# EAGLE design elysium_v0_6 (EAGLE 6.5.0)
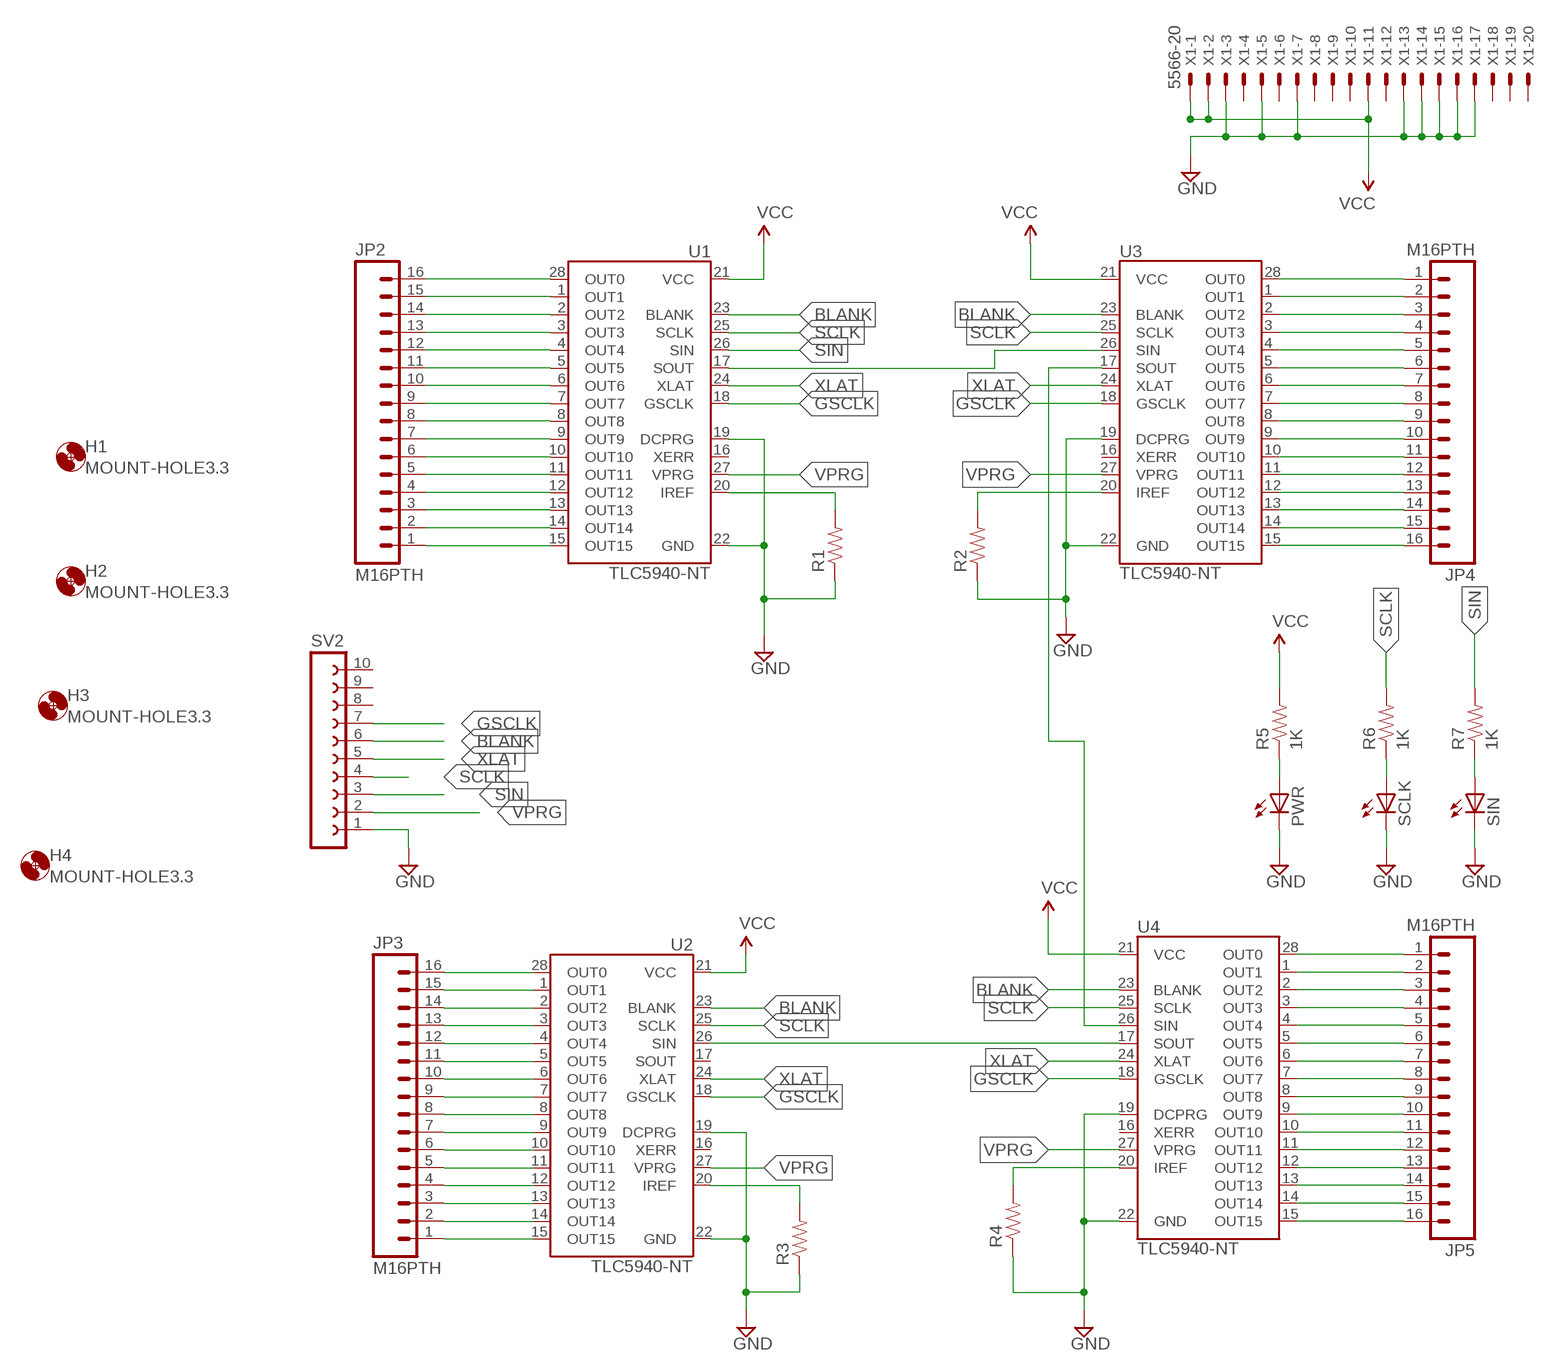
[diagram p0: schematic, sheet 1]

## Parts
H1  MOUNT-HOLE3.3  [3,3]
H2  MOUNT-HOLE3.3  [3,3]
H3  MOUNT-HOLE3.3  [3,3]
H4  MOUNT-HOLE3.3  [3,3]
JP2  M16PTH  [1X16]
JP3  M16PTH  [1X16]
JP4  M16PTH  [1X16]
JP5  M16PTH  [1X16]
PWR  LED5MM  [LED5MM]
R1  RESISTOREZ  [AXIAL-0.3EZ]
R2  RESISTOREZ  [AXIAL-0.3EZ]
R3  RESISTOREZ  [AXIAL-0.3EZ]
R4  RESISTOREZ  [AXIAL-0.3EZ]
R5  1K  RESISTOREZ  [AXIAL-0.3EZ]
R6  1K  RESISTOREZ  [AXIAL-0.3EZ]
R7  1K  RESISTOREZ  [AXIAL-0.3EZ]
SCLK  LED5MM  [LED5MM]
SIN  LED5MM  [LED5MM]
SV2  FE10-1  [FE10]
U1  TLC5940-NT  [DIL28-3]
U2  TLC5940-NT  [DIL28-3]
U3  TLC5940-NT  [DIL28-3]
U4  TLC5940-NT  [DIL28-3]
X1  5566-20  [5566-20]

## Nets
BLANK: SV2.6 U1.23(BLANK) U2.23(BLANK) U3.23(BLANK) U4.23(BLANK)
GND: PWR.K(C) R1.P$1 R2.P$1 R3.P$1 R4.P$1 SCLK.K(C) SIN.K(C) SV2.1 U1.19(DCPRG) U1.22(GND) U2.19(DCPRG) U2.22(GND) U3.19(DCPRG) U3.22(GND) U4.19(DCPRG) U4.22(GND) X1.3 X1.5 X1.7 X1.13 X1.14 X1.15 X1.16 X1.17
GSCLK: SV2.7 U1.18(GSCLK) U2.18(GSCLK) U3.18(GSCLK) U4.18(GSCLK)
N$1: JP2.16 U1.28(OUT0)
N$2: JP2.15 U1.1(OUT1)
N$3: JP2.14 U1.2(OUT2)
N$4: JP2.13 U1.3(OUT3)
N$5: JP2.12 U1.4(OUT4)
N$6: JP2.11 U1.5(OUT5)
N$7: JP2.10 U1.6(OUT6)
N$8: JP2.9 U1.7(OUT7)
N$9: JP2.8 U1.8(OUT8)
N$10: JP2.7 U1.9(OUT9)
N$11: JP2.6 U1.10(OUT10)
N$12: JP2.5 U1.11(OUT11)
N$13: JP2.4 U1.12(OUT12)
N$14: JP2.3 U1.13(OUT13)
N$15: JP2.2 U1.14(OUT14)
N$16: JP2.1 U1.15(OUT15)
N$17: JP4.1 U3.28(OUT0)
N$18: JP4.2 U3.1(OUT1)
N$19: JP4.3 U3.2(OUT2)
N$20: JP4.4 U3.3(OUT3)
N$21: JP4.5 U3.4(OUT4)
N$22: JP4.6 U3.5(OUT5)
N$23: JP4.7 U3.6(OUT6)
N$24: JP4.8 U3.7(OUT7)
N$25: JP4.9 U3.8(OUT8)
N$26: JP4.10 U3.9(OUT9)
N$27: JP4.11 U3.10(OUT10)
N$28: JP4.12 U3.11(OUT11)
N$29: JP4.13 U3.12(OUT12)
N$30: JP4.14 U3.13(OUT13)
N$31: JP4.15 U3.14(OUT14)
N$32: JP4.16 U3.15(OUT15)
N$33: JP3.16 U2.28(OUT0)
N$34: JP3.15 U2.1(OUT1)
N$35: JP3.14 U2.2(OUT2)
N$36: JP3.13 U2.3(OUT3)
N$37: JP3.12 U2.4(OUT4)
N$38: JP3.11 U2.5(OUT5)
N$39: JP3.10 U2.6(OUT6)
N$40: JP3.9 U2.7(OUT7)
N$41: JP3.8 U2.8(OUT8)
N$42: JP3.7 U2.9(OUT9)
N$43: JP3.6 U2.10(OUT10)
N$44: JP3.5 U2.11(OUT11)
N$45: JP3.4 U2.12(OUT12)
N$46: JP3.3 U2.13(OUT13)
N$47: JP3.2 U2.14(OUT14)
N$48: JP3.1 U2.15(OUT15)
N$49: JP5.1 U4.28(OUT0)
N$50: JP5.2 U4.1(OUT1)
N$51: JP5.3 U4.2(OUT2)
N$52: JP5.4 U4.3(OUT3)
N$53: JP5.5 U4.4(OUT4)
N$54: JP5.6 U4.5(OUT5)
N$55: JP5.7 U4.6(OUT6)
N$56: JP5.8 U4.7(OUT7)
N$57: JP5.9 U4.8(OUT8)
N$58: JP5.10 U4.9(OUT9)
N$59: JP5.11 U4.10(OUT10)
N$60: JP5.12 U4.11(OUT11)
N$61: JP5.13 U4.12(OUT12)
N$62: JP5.14 U4.13(OUT13)
N$63: JP5.15 U4.14(OUT14)
N$64: JP5.16 U4.15(OUT15)
N$65: U1.17(SOUT) U3.26(SIN)
N$66: U3.17(SOUT) U4.26(SIN)
N$67: U2.26(SIN) U4.17(SOUT)
N$68: R1.P$2 U1.20(IREF)
N$69: PWR.A R5.P$1
N$70: R2.P$2 U3.20(IREF)
N$74: R6.P$1 SCLK.A
N$75: R3.P$2 U2.20(IREF)
N$76: R7.P$1 SIN.A
N$77: R4.P$2 U4.20(IREF)
SCLK: R6.P$2 SV2.4 U1.25(SCLK) U2.25(SCLK) U3.25(SCLK) U4.25(SCLK)
SIN: R7.P$2 SV2.3 U1.26(SIN)
VCC: R5.P$2 U1.21(VCC) U2.21(VCC) U3.21(VCC) U4.21(VCC) X1.1 X1.2 X1.11
VPRG: SV2.2 U1.27(VPRG) U2.27(VPRG) U3.27(VPRG) U4.27(VPRG)
XLAT: SV2.5 U1.24(XLAT) U2.24(XLAT) U3.24(XLAT) U4.24(XLAT)
Unconnected: SV2.8 SV2.9 SV2.10 U1.16(XERR) U2.16(XERR) U2.17(SOUT) U3.16(XERR) U4.16(XERR) X1.4 X1.6 X1.8 X1.9 X1.10 X1.12 X1.18 X1.19 X1.20

## Library data of the parts
H1-H4 = holes:MOUNT-HOLE: MOUNTING HOLE with drill center marker
JP2-JP5 = SparkFun-Connectors:M16: 1x16 .1" header
PWR SCLK SIN = adafruit:LED: LED OSRAM: - CHIPLED LG R971, LG N971, LY N971, LG Q971, LY Q971, LO R971, LY R971 LH N974, LH R974 LS Q976, LO Q976, LY Q976 LO Q996 - Hyper CHIPLED LW Q18S LB Q993, LB Q99A, LB R99A - SideLED LS A670, LO A670, LY A670, LG A670, LP A670 LB A673, LV A673, LT A673, LW A673 LH A674 LY A675 LS A676, LA A676, LO A676, LY A676, LW A676 LS A679, LY A679, LG A679 - Hyper Micro SIDELED® LS Y876, LA Y876, LO Y876, LY Y876 LT Y87S - SmartLED LW L88C, LW L88S LB L89C, LB L89S, LG L890 LS L89K, LO L89K, LY L89K LS L896, LA L896, LO L896, LY L896 - TOPLED LS T670, LO T670, LY T670, LG T670, LP T670 LSG T670, LSP T670, LSY T670, LOP T670, LYG T670 LG T671, LOG T671, LSG T671 LB T673, LV T673, LT T673, LW T673 LH T674 LS T676, LA T676, LO T676, LY T676, LB T676, LH T676, LSB T676, LW T676 LB T67C, LV T67C, LT T67C, LS T67K, LO T67K, LY T67K, LW E67C LS E67B, LA E67B, LO E67B, LY E67B, LB E67C, LV E67C, LT E67C LW T67C LS T679, LY T679, LG T679 LS T770, LO T770, LY T770, LG T770, LP T770 LB T773, LV T773, LT T773, LW T773 LH T774 LS E675, LA E675, LY E675, LS T675 LS T776, LA T776, LO T776, LY T776, LB T776 LHGB T686 LT T68C, LB T68C - Hyper Mini TOPLED® LB M676 - Mini TOPLED Santana® LG M470 LS M47K, LO M47K, LY M47K Source: http://www.osram.convergy.de/
R1-R7 = SparkFun-Resistors:RESISTOR: Resistor Basic schematic elements and footprints for 0603, 1206, and PTH resistors.
SV2 = con-lsta:FE10-1: FEMALE HEADER; OC_FARNELL: unknown; OC_NEWARK: unknown
U1-U4 = SparkFun-DigitalIC:TLC5940: 16-channel LED Driver with Dot Correction and Grayscale PWM Control The TLC5940 is a 16-channel, constant-current sink LED driver. Each channel has an individually adjustable 4096-step grayscale PWM brightness control and a 64-step, constant-current sink (dot correction). The dot correction adjusts the brightness variations between LED channels and other LED drivers. The dot correction data is stored in an integrated EEPROM. Both grayscale control and dot correction are accessible via a serial interface. A single external resistor sets the maximum current value of all 16 channels. Packages: 28-pin HTSSOP 32-pin 5x5mm QFN 28-pin DIP
X1 = con-molex:5566-20: Mini FIT connector 20 pol ATX PC-Motherboard Power connector Source: http://www.molex.com; OC_FARNELL: unknown; OC_NEWARK: unknown

## Board
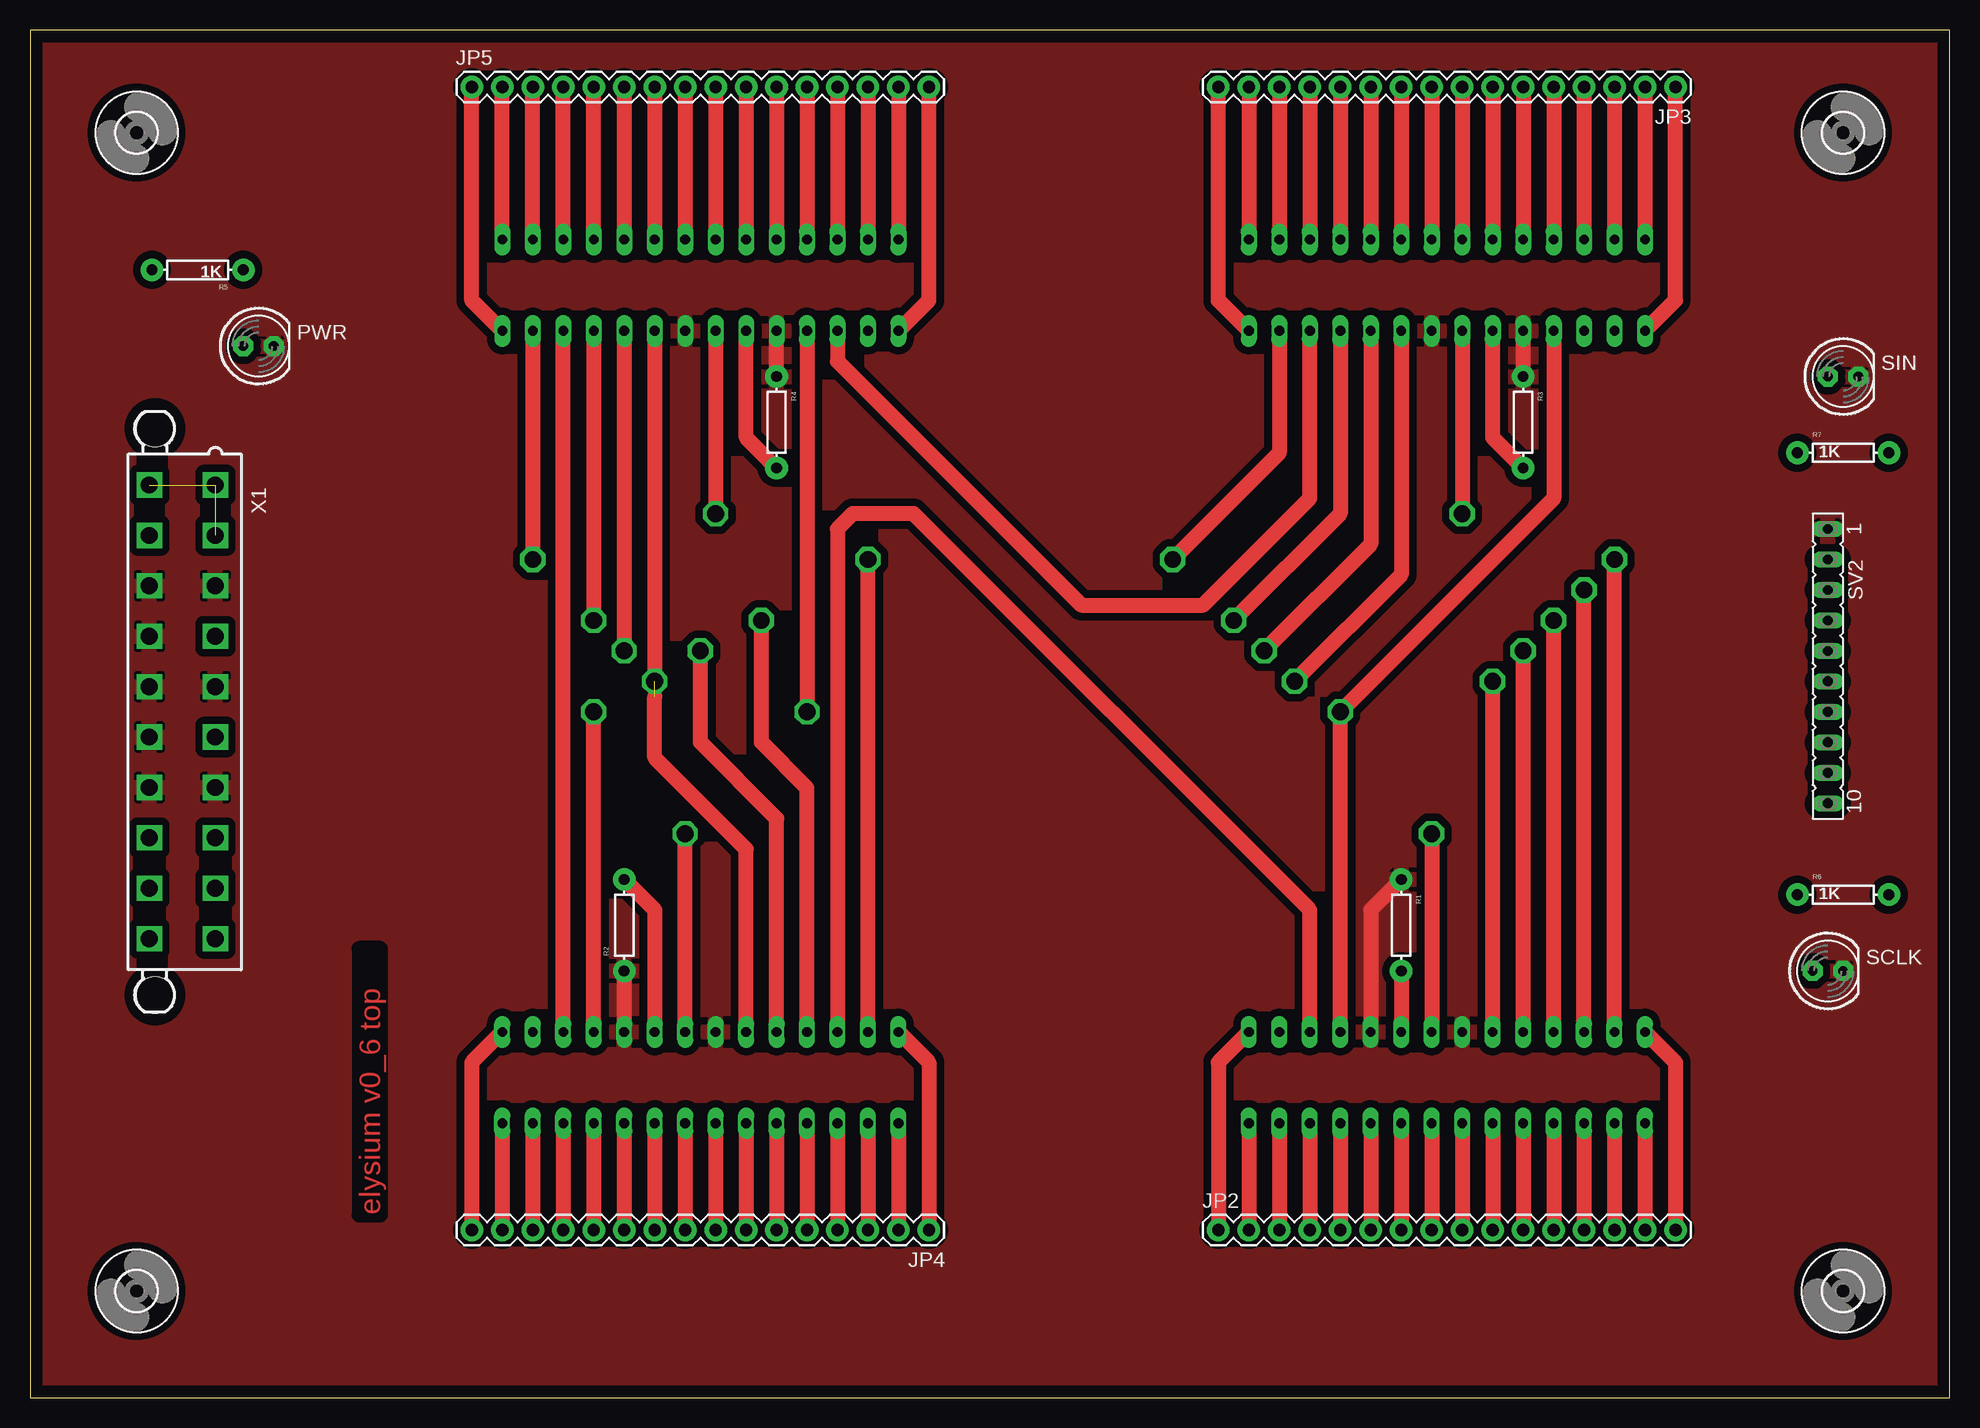
[diagram p1: board, top side]
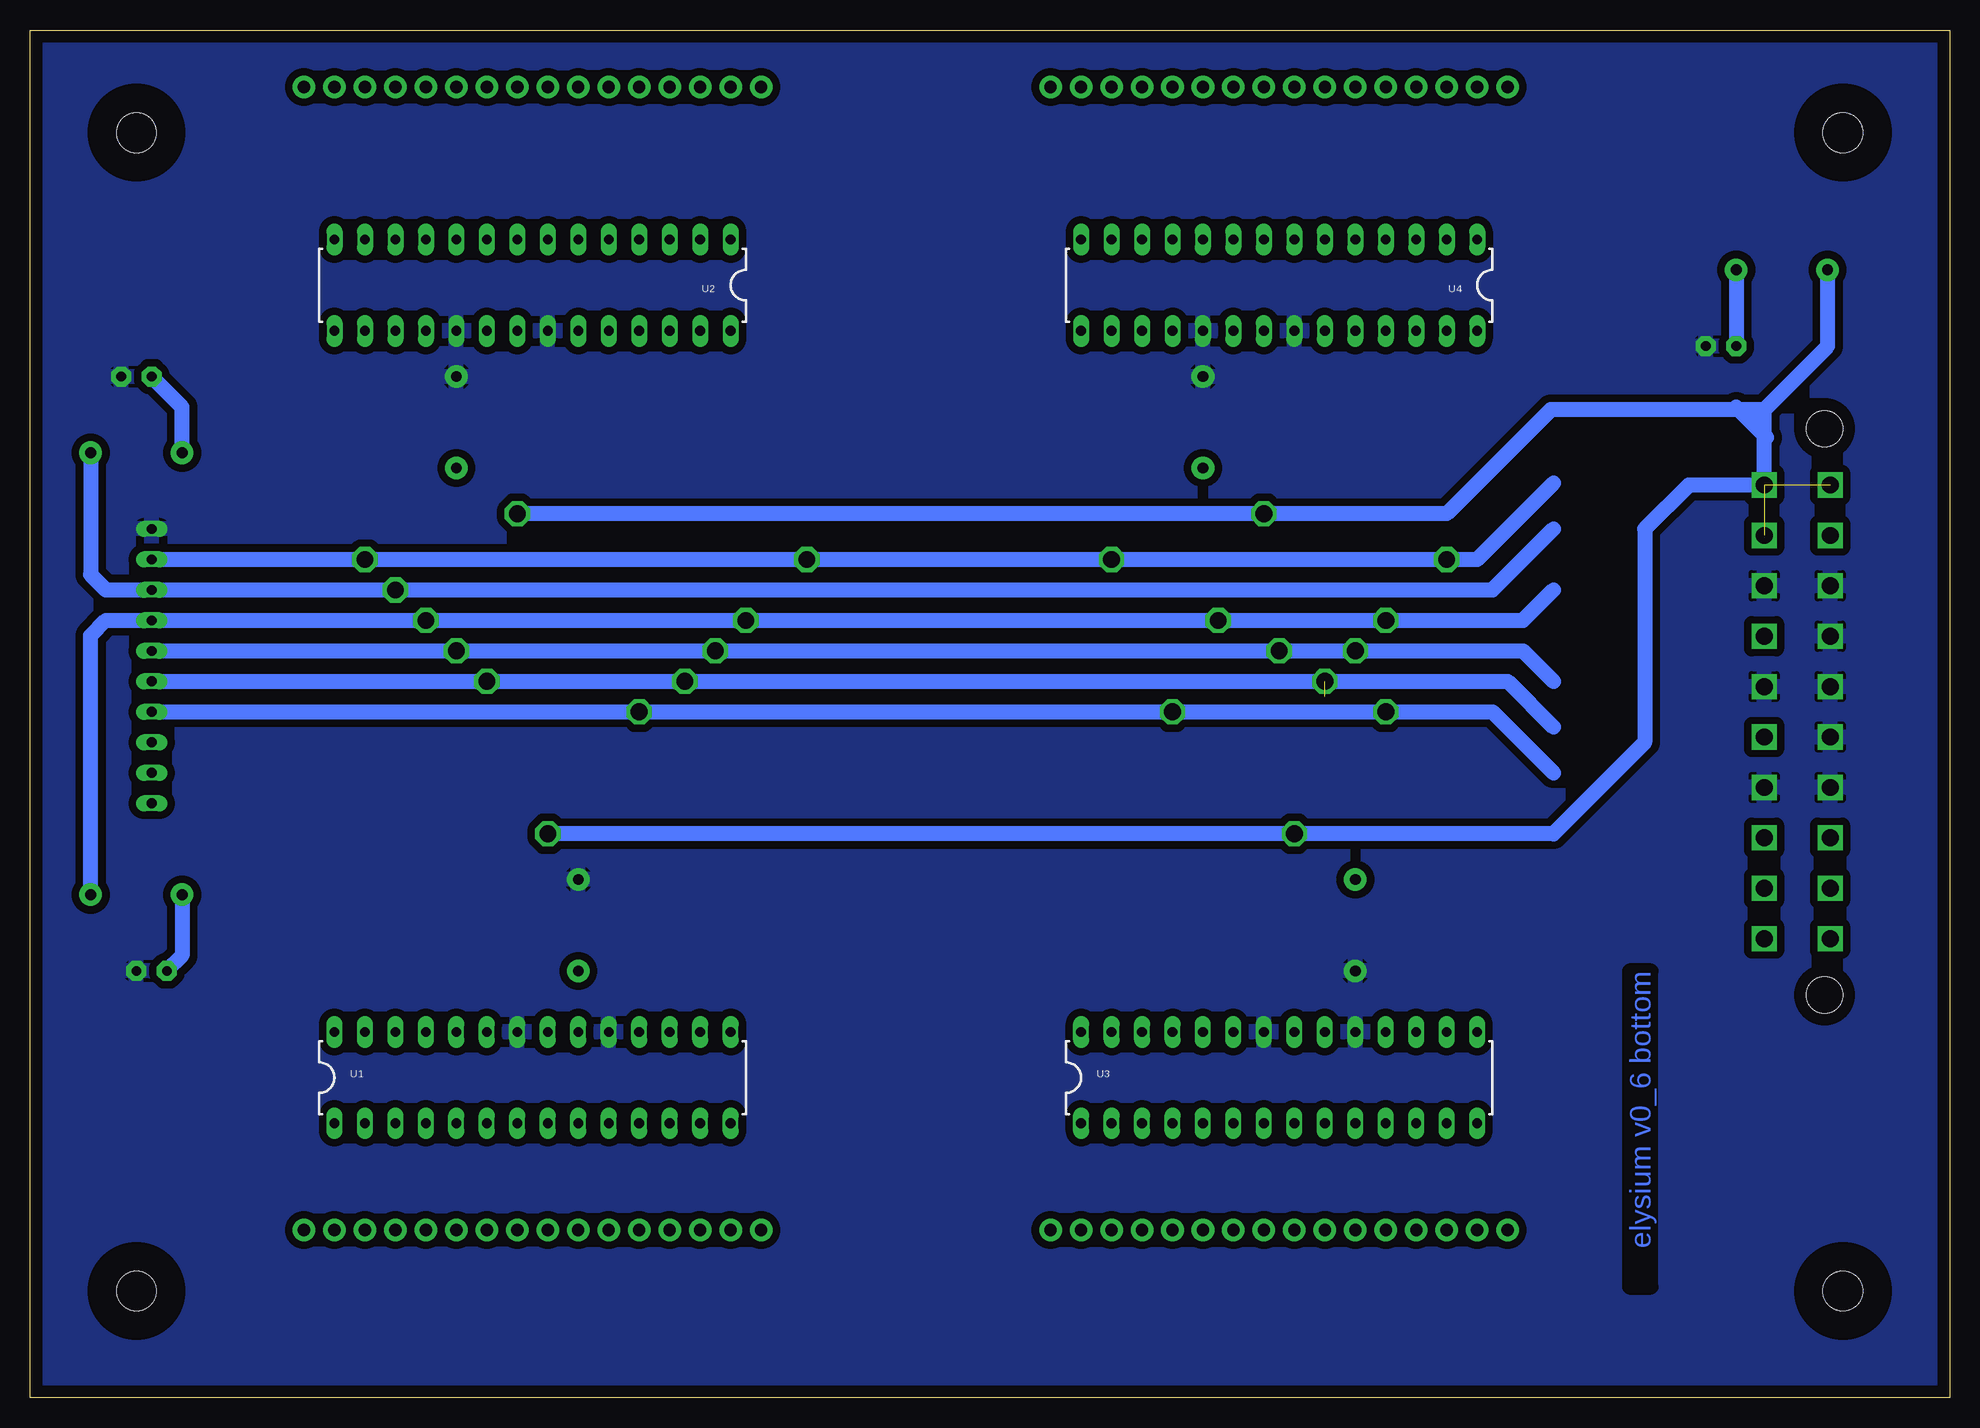
[diagram p2: board, bottom side, seen from below]

Size 160 x 113.97 mm. Coordinates in mm from the lower left corner, seen from the top.
Outline: 0,0 160,0 160,113.97 0,113.97 0,0
Copper layers (1*16): Top 0.035mm / dielectric 1.5mm / Bottom 0.035mm
Design rules "default *": minimum track width 24mil, minimum drill 24mil, track to track 25mil, track to pad 25mil, pad to pad 25mil, via to via 25mil, smd to smd 8mil, copper to edge 40mil, drill to drill 8mil, minimum pad ring 10mil, minimum via ring 8mil, stop-mask expansion 4mil, vias tented up to drill 0mil, thermal gap 10mil

### Footprints (pad centres in the part's own frame; a part is rotated, then mirrored left to right if it is on the bottom)
3,3 = hole 3.3: 0,0
1X16 = drill 1.016 pad 1.88: 1 0,0; 2 2.54,0; 3 5.08,0; 4 7.62,0; 5 10.16,0; 6 12.7,0; 7 15.24,0; 8 17.78,0; 9 20.32,0; 10 22.86,0; 11 25.4,0; 12 27.94,0; 13 30.48,0; 14 33.02,0; 15 35.56,0; 16 38.1,0
LED5MM = drill 0.813 pad 1.676 octagon: A -1.27,0; K 1.27,0
AXIAL-0.3EZ = drill 0.9 pad 1.88: P$1 -3.81,0; P$2 3.81,0
FE10 = drill 0.813 long: 1 -11.43,0; 2 -8.89,0; 3 -6.35,0; 4 -3.81,0; 5 -1.27,0; 6 1.27,0; 7 3.81,0; 8 6.35,0; 9 8.89,0; 10 11.43,0
DIL28-3 = drill 0.813 long: 1 -16.51,-3.81; 2 -13.97,-3.81; 3 -11.43,-3.81; 4 -8.89,-3.81; 5 -6.35,-3.81; 6 -3.81,-3.81; 7 -1.27,-3.81; 8 1.27,-3.81; 9 3.81,-3.81; 10 6.35,-3.81; 11 8.89,-3.81; 12 11.43,-3.81; 13 13.97,-3.81; 14 16.51,-3.81; 15 16.51,3.81; 16 13.97,3.81; 17 11.43,3.81; 18 8.89,3.81; 19 6.35,3.81; 20 3.81,3.81; 21 1.27,3.81; 22 -1.27,3.81; 23 -3.81,3.81; 24 -6.35,3.81; 25 -8.89,3.81; 26 -11.43,3.81; 27 -13.97,3.81; 28 -16.51,3.81
5566-20 = drill 1.4 square: 1 18.9,-2.75; 2 14.7,-2.75; 3 10.5,-2.75; 4 6.3,-2.75; 5 2.1,-2.75; 6 -2.1,-2.75; 7 -6.3,-2.75; 8 -10.5,-2.75; 9 -14.7,-2.75; 10 -18.9,-2.75; 11 18.9,2.75; 12 14.7,2.75; 13 10.5,2.75; 14 6.3,2.75; 15 2.1,2.75; 16 -2.1,2.75; 17 -6.3,2.75; 18 -10.5,2.75; 19 -14.7,2.75; 20 -18.9,2.75 | hole 3: 23.6,2.29; -23.6,2.29

### Placement (x,y rotation side)
H1  8.89,105.41 0 top
H2  8.89,8.89 0 top
H3  151.13,105.41 0 top
H4  151.13,8.89 0 top
JP2  99.06,13.97 0 top
JP3  137.16,109.22 180 top
JP4  74.93,13.97 180 top
JP5  36.83,109.22 0 top
PWR  19.05,87.63 0 top
R1  114.3,39.37 270 top
R2  49.53,39.37 90 top
R3  124.46,81.28 270 top
R4  62.23,81.28 270 top
R5  13.97,93.98 180 top
R6  151.13,41.91 0 top
R7  151.13,78.74 0 top
SCLK  149.86,35.56 0 top
SIN  151.13,85.09 0 top
SV2  149.86,60.96 270 top
U1  118.11,26.67 0 bottom
U2  118.11,92.71 180 bottom
U3  55.88,26.67 0 bottom
U4  55.88,92.71 180 bottom
X1  12.7,57.15 90 top

### Tracks (layer width: path | path; a pad name or v marks a point on that pad's centre or on a via)
BLANK  (via drill 1.4)  (1 unrouted)
  Top 1.27: U4.23 v52.07,59.69 | U3.23 59.69,45.72 52.07,53.34 52.07,58.42 | U1.23 v121.92,59.69 | U2.23 114.3,68.58 v105.41,59.69
  Bottom 1.27: SV2.6 v121.92,59.69 v105.41,59.69 v52.07,59.69 36.83,59.69 33.02,55.88
GND
  Top 1.27: R4.P$1 U4.19 | R3.P$1 U2.19 | R2.P$1 U3.19 | R1.P$1 111.76,40.64 U1.19
  pour Top: -8.89,116.84 -8.89,-3.81 -7.62,-5.08 161.29,-5.08 166.37,0 166.37,111.76 160.02,118.11 -7.62,118.11
  pour Bottom: -13.97,120.65 -13.97,-5.08 -7.62,-11.43 160.02,-11.43 173.99,2.54 173.99,111.76 162.56,123.19 -11.43,123.19
GSCLK  (via drill 1.4)
  Top 1.27: U4.18 v64.77,57.15 | U3.18 v46.99,57.15 | U1.18 v109.22,57.15 127,74.93 U2.18
  Bottom 1.27: SV2.7 v109.22,57.15 v64.77,57.15 v46.99,57.15 38.1,57.15 33.02,52.07
N$1
  Top 1.27: U1.28 137.16,27.94 JP2.16
N$2
  Top 1.27: U1.1 JP2.15
N$3
  Top 1.27: U1.2 JP2.14
N$4
  Top 1.27: U1.3 JP2.13
N$5
  Top 1.27: U1.4 JP2.12
N$6
  Top 1.27: U1.5 JP2.11
N$7
  Top 1.27: U1.6 JP2.10
N$8
  Top 1.27: U1.7 JP2.9
N$9
  Top 1.27: U1.8 JP2.8
N$10
  Top 1.27: U1.9 JP2.7
N$11
  Top 1.27: U1.10 JP2.6
N$12
  Top 1.27: U1.11 JP2.5
N$13
  Top 1.27: U1.12 JP2.4
N$14
  Top 1.27: U1.13 JP2.3
N$15
  Top 1.27: U1.14 JP2.2
N$16
  Top 1.27: U1.15 99.06,27.94 JP2.1
N$17
  Top 1.27: U3.28 74.93,27.94 JP4.1
N$18
  Top 1.27: U3.1 JP4.2
N$19
  Top 1.27: U3.2 JP4.3
N$20
  Top 1.27: U3.3 JP4.4
N$21
  Top 1.27: U3.4 JP4.5
N$22
  Top 1.27: U3.5 JP4.6
N$23
  Top 1.27: U3.6 JP4.7
N$24
  Top 1.27: U3.7 JP4.8
N$25
  Top 1.27: U3.8 JP4.9
N$26
  Top 1.27: U3.9 JP4.10
N$27
  Top 1.27: U3.10 JP4.11
N$28
  Top 1.27: U3.11 JP4.12
N$29
  Top 1.27: U3.12 JP4.13
N$30
  Top 1.27: U3.13 JP4.14
N$31
  Top 1.27: U3.14 JP4.15
N$32
  Top 1.27: U3.15 36.83,27.94 JP4.16
N$33
  Top 1.27: U2.28 99.06,91.44 JP3.16
N$34
  Top 1.27: JP3.15 U2.1
N$35
  Top 1.27: JP3.14 U2.2
N$36
  Top 1.27: JP3.13 U2.3
N$37
  Top 1.27: JP3.12 U2.4
N$38
  Top 1.27: JP3.11 U2.5
N$39
  Top 1.27: JP3.10 U2.6
N$40
  Top 1.27: JP3.9 U2.7
N$41
  Top 1.27: JP3.8 U2.8
N$42
  Top 1.27: JP3.7 U2.9
N$43
  Top 1.27: JP3.6 U2.10
N$44
  Top 1.27: JP3.5 U2.11
N$45
  Top 1.27: JP3.4 U2.12
N$46
  Top 1.27: JP3.3 U2.13
N$47
  Top 1.27: JP3.2 U2.14
N$48
  Top 1.27: U2.15 137.16,91.44 JP3.1
N$49
  Top 1.27: U4.28 36.83,91.44 JP5.1
N$50
  Top 1.27: U4.1 JP5.2
N$51
  Top 1.27: U4.2 JP5.3
N$52
  Top 1.27: U4.3 JP5.4
N$53
  Top 1.27: U4.4 JP5.5
N$54
  Top 1.27: JP5.6 U4.5
N$55
  Top 1.27: JP5.7 U4.6
N$56
  Top 1.27: JP5.8 U4.7
N$57
  Top 1.27: JP5.9 U4.8
N$58
  Top 1.27: JP5.10 U4.9
N$59
  Top 1.27: JP5.11 U4.10
N$60
  Top 1.27: JP5.12 U4.11
N$61
  Top 1.27: JP5.13 U4.12
N$62
  Top 1.27: JP5.14 U4.13
N$63
  Top 1.27: JP5.15 U4.14
N$64
  Top 1.27: U4.15 74.93,91.44 JP5.16
N$65
  Top 1.27: U1.17 106.68,40.64 73.66,73.66 68.58,73.66 67.31,72.39 U3.26
N$66
  Top 1.27: U3.17 U4.26
N$67
  Top 1.27: U4.17 67.31,86.36 87.63,66.04 97.79,66.04 106.68,74.93 U2.26
N$68
  Top 1.27: R1.P$2 U1.20
N$69
  Bottom 1.27: R5.P$1 PWR.A
N$70
  Top 1.27: R2.P$2 52.07,40.64 U3.20
N$72
  Bottom 1.27: 17.78,82.55 15.24,80.01
N$74
  Bottom 1.27: R6.P$1 147.32,36.83 SCLK.A
N$75
  Top 1.27: R3.P$2 121.92,80.01 U2.20
N$76
  Bottom 1.27: R7.P$1 147.32,82.55 SIN.A
N$77
  Top 1.27: R4.P$2 59.69,80.01 U4.20
SCLK  (via drill 1.4)
  Top 1.27: U4.25 v46.99,64.77 | U3.25 64.77,50.8 60.96,54.61 v60.96,64.77 | U1.25 v127,64.77 | U2.25 109.22,73.66 v100.33,64.77
  Bottom 1.27: 33.02,67.31 35.56,64.77 v46.99,64.77 v60.96,64.77 v100.33,64.77 v127,64.77 SV2.4 153.67,64.77 154.94,63.5 R6.P$2
SIN  (via drill 1.4)
  Top 1.27: U1.26 v129.54,67.31
  Bottom 1.27: 33.02,72.39 38.1,67.31 v129.54,67.31 SV2.3 153.67,67.31 154.94,68.58 R7.P$2
VCC  (via drill 1.4)  (2 unrouted)
  Top 1.27: U4.21 v57.15,73.66 | U2.21 v119.38,73.66 | v116.84,46.99 U1.21 | U3.21 v54.61,46.99
  Bottom 1.27: 15.45,82.34 X1.1 21.74,76.05 25.4,72.39 25.4,54.61 33.02,46.99 v54.61,46.99 v116.84,46.99 | 15.45,82.34 10.16,87.63 R5.P$2 | 15.45,82.34 33.23,82.34 41.91,73.66 v57.15,73.66 v119.38,73.66
VPRG  (via drill 1.4)
  Top 1.27: U4.27 v41.91,69.85 | U3.27 v69.85,69.85 | U1.27 v132.08,69.85 | U2.27 104.14,78.74 v95.25,69.85
  Bottom 1.27: SV2.2 v132.08,69.85 v95.25,69.85 v69.85,69.85 v41.91,69.85 39.37,69.85 33.02,76.2
XLAT  (via drill 1.4)
  Top 1.27: U4.24 v49.53,62.23 | U3.24 62.23,48.26 55.88,54.61 v55.88,62.23 | U1.24 v124.46,62.23 | U2.24 111.76,71.12 v102.87,62.23
  Bottom 1.27: SV2.5 v124.46,62.23 v102.87,62.23 v55.88,62.23 v49.53,62.23 35.56,62.23 33.02,59.69

### Text on the board
Top: elysium v0_6 top
Bottom: elysium v0_6 bottom